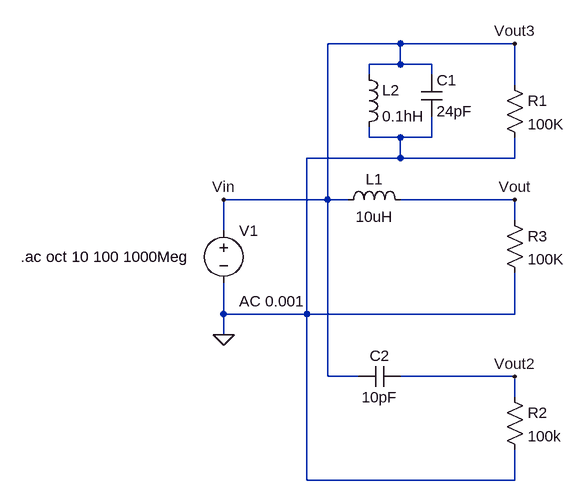
[diagram p0: schematic Filter_004.asc]
Filter_004.asc, the LTspice schematic file:
Version 4
SHEET 1 880 680
WIRE 288 -304 176 -304
WIRE 464 -304 288 -304
WIRE 288 -272 288 -304
WIRE 288 -272 240 -272
WIRE 336 -272 288 -272
WIRE 240 -256 240 -272
WIRE 336 -256 336 -272
WIRE 464 -240 464 -304
WIRE 240 -160 240 -176
WIRE 288 -160 240 -160
WIRE 336 -160 336 -192
WIRE 336 -160 288 -160
WIRE 288 -128 288 -160
WIRE 288 -128 144 -128
WIRE 464 -128 464 -160
WIRE 464 -128 288 -128
WIRE 176 -64 176 -304
WIRE 176 -64 16 -64
WIRE 208 -64 176 -64
WIRE 464 -64 288 -64
WIRE 464 -32 464 -64
WIRE 16 -16 16 -64
WIRE 16 112 16 64
WIRE 144 112 144 -128
WIRE 144 112 16 112
WIRE 464 112 464 48
WIRE 464 112 144 112
WIRE 16 144 16 112
WIRE 176 208 176 -64
WIRE 224 208 176 208
WIRE 464 208 288 208
WIRE 464 240 464 208
WIRE 144 368 144 112
WIRE 464 368 464 320
WIRE 464 368 144 368
FLAG 16 144 0
FLAG 16 -64 Vin
FLAG 464 -64 Vout
FLAG 464 208 Vout2
FLAG 464 -304 Vout3
SYMBOL ind 192 -48 R270
WINDOW 0 32 56 VTop 2
WINDOW 3 5 56 VBottom 2
SYMATTR InstName L1
SYMATTR Value 10uH
SYMATTR SpiceLine Ipk=370mA Rser=0.75Ω
SYMBOL voltage 16 -32 R0
WINDOW 123 24 124 Left 2
WINDOW 39 0 0 Left 0
SYMATTR Value2 AC 0.001
SYMATTR InstName V1
SYMATTR Value ""
SYMBOL cap 288 192 R90
WINDOW 0 0 32 VBottom 2
WINDOW 3 32 32 VTop 2
SYMATTR InstName C2
SYMATTR Value 10pF
SYMBOL res 448 224 R0
SYMATTR InstName R2
SYMATTR Value 100k
SYMBOL res 448 -256 R0
SYMATTR InstName R1
SYMATTR Value 100K
SYMBOL res 448 -48 R0
SYMATTR InstName R3
SYMATTR Value 100K
SYMBOL ind 224 -272 R0
SYMATTR InstName L2
SYMATTR Value 0.1hH
SYMATTR SpiceLine Ipk=815mA Rser=0.15Ω
SYMBOL cap 320 -256 R0
SYMATTR InstName C1
SYMATTR Value 24pF
TEXT -296 24 Left 2 !.ac oct 10 100 1000Meg

The netlist it stands for:
* Filter_004.asc
L1 Vout3 Vout 10uH Ipk=370mA Rser=0.75Ω
V1 Vout3 0 AC 0.001
C2 Vout2 Vout3 10pF
R2 Vout2 0 100k
R1 Vout3 0 100K
R3 Vout 0 100K
L2 Vout3 0 0.1hH Ipk=815mA Rser=0.15Ω
C1 Vout3 0 24pF
.ac oct 10 100 1000Meg
.backanno
.end